# Altium schematic sheet Motor.SchDoc
size A4; Revision: 0
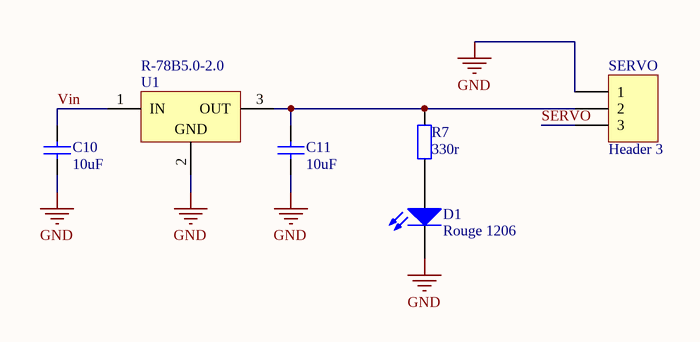
[diagram p0: Motor.SchDoc]

## Parts
C10  10uF  [1206-C]
C11  10uF  [1206-C]
D1  Rouge 1206  [1206-Led-R]
R7  330r  [0805-R]
SERVO  Header 3  [HDR1X3]
U1  R-78B5.0-2.0  [R78HB50V]

## Nets
GND: C10.1 C11.1 D1.1(K) SERVO.1 U1.2(GND)
SERVO: SERVO.3
Vin: C10.2 U1.1(IN)
NetC11_2: C11.2 R7.2 SERVO.2 U1.3(OUT)
NetD1_2: D1.2(A) R7.1

## Notes on the sheet
- Title
- Size:
- Date:
- A4
- Number:
- Time:
- Revision:
- Sheet
- of
- File:

## Library data of the parts
C10 C11 = Cap_np: Condensateur céramique multicouche CMS, 10 µF, 25 V, 1206 [3216 Metric], ± 10%, X5R, Série MC; Fabricant: MULTICOMP PRO; Fournisseur: Farnell; RefFabricant: MC1206X106K250CT; RefFournisseur: 2320887; Voltage: 25V; Valeur: 10uF
D1 = LED CMS 1206 Red: LED, Basse puissance, Rouge, CMS, 1206 (Métrique 3216), 20 mA, 1.85 V, 640 nm; Fabricant: KINGBRIGHT; Fournisseur: Farnell; RefFabricant: KPTD-3216SRC-PRV; RefFournisseur: 2001662; Voltage: 1.85V; Revision: July-2002: Re-released for DXP Platform.; Valeur: Rouge 1206
R7 = Res: Résistance à puce CMS, Couche épaisse, 330 ohm, ± 1%, 125 mW, 0805 [2012 Metric], Couche épaisse; Fabricant: MULTICOMP PRO; Fournisseur: Farnell; RefFabricant: MCWR08X3300FTL; RefFournisseur: 2447638; Voltage: 150V; Valeur: 330r
SERVO = Header 3: Header mâle, Carte-à-carte, 2.54 mm, 1 Rangée(s), 10 Contact(s), Traversant, droit, Série 2211S; Fabricant: MULTICOMP PRO; Fournisseur: Farnell; RefFabricant: 2211S-10G; RefFournisseur: 1593417; Valeur: 10 cts
U1 = R78HB50: Convertisseur DC/DC POL non isolé, 1 sortie, 10 W, 5 V, 2 A, Fixe, Traversant; Fabricant: RECOM POWER; Fournisseur: Farnell; RefFournisseur: 2747528; Voltage: IN 6.5V-32V ; OUT 5V; RefFabricant: R-78B5.0-2.0